# Altium schematic sheet SquidChanVoltageRef.SchDoc
size Letter; DrawnBy: J.-F. Cliche; Engineer: J.-F. Cliche; Revision: Rev0; ProjectTitle: Squid Controller 2012
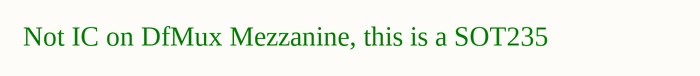
[diagram p0: SquidChanVoltageRef.SchDoc]

## Notes on the sheet
- Not IC on DfMux Mezzanine, this is a SOT235
- File:
- Size:
- Date:
- Letter
- Revision:
- Sheet
- of
- Cosmology
- Drawn by: